# Altium schematic sheet PROBA.SchDoc: ATLAS_XP2V5
size 558 x 431 mm; Organization: IMP Automatika d.o.o.; Revision: V5
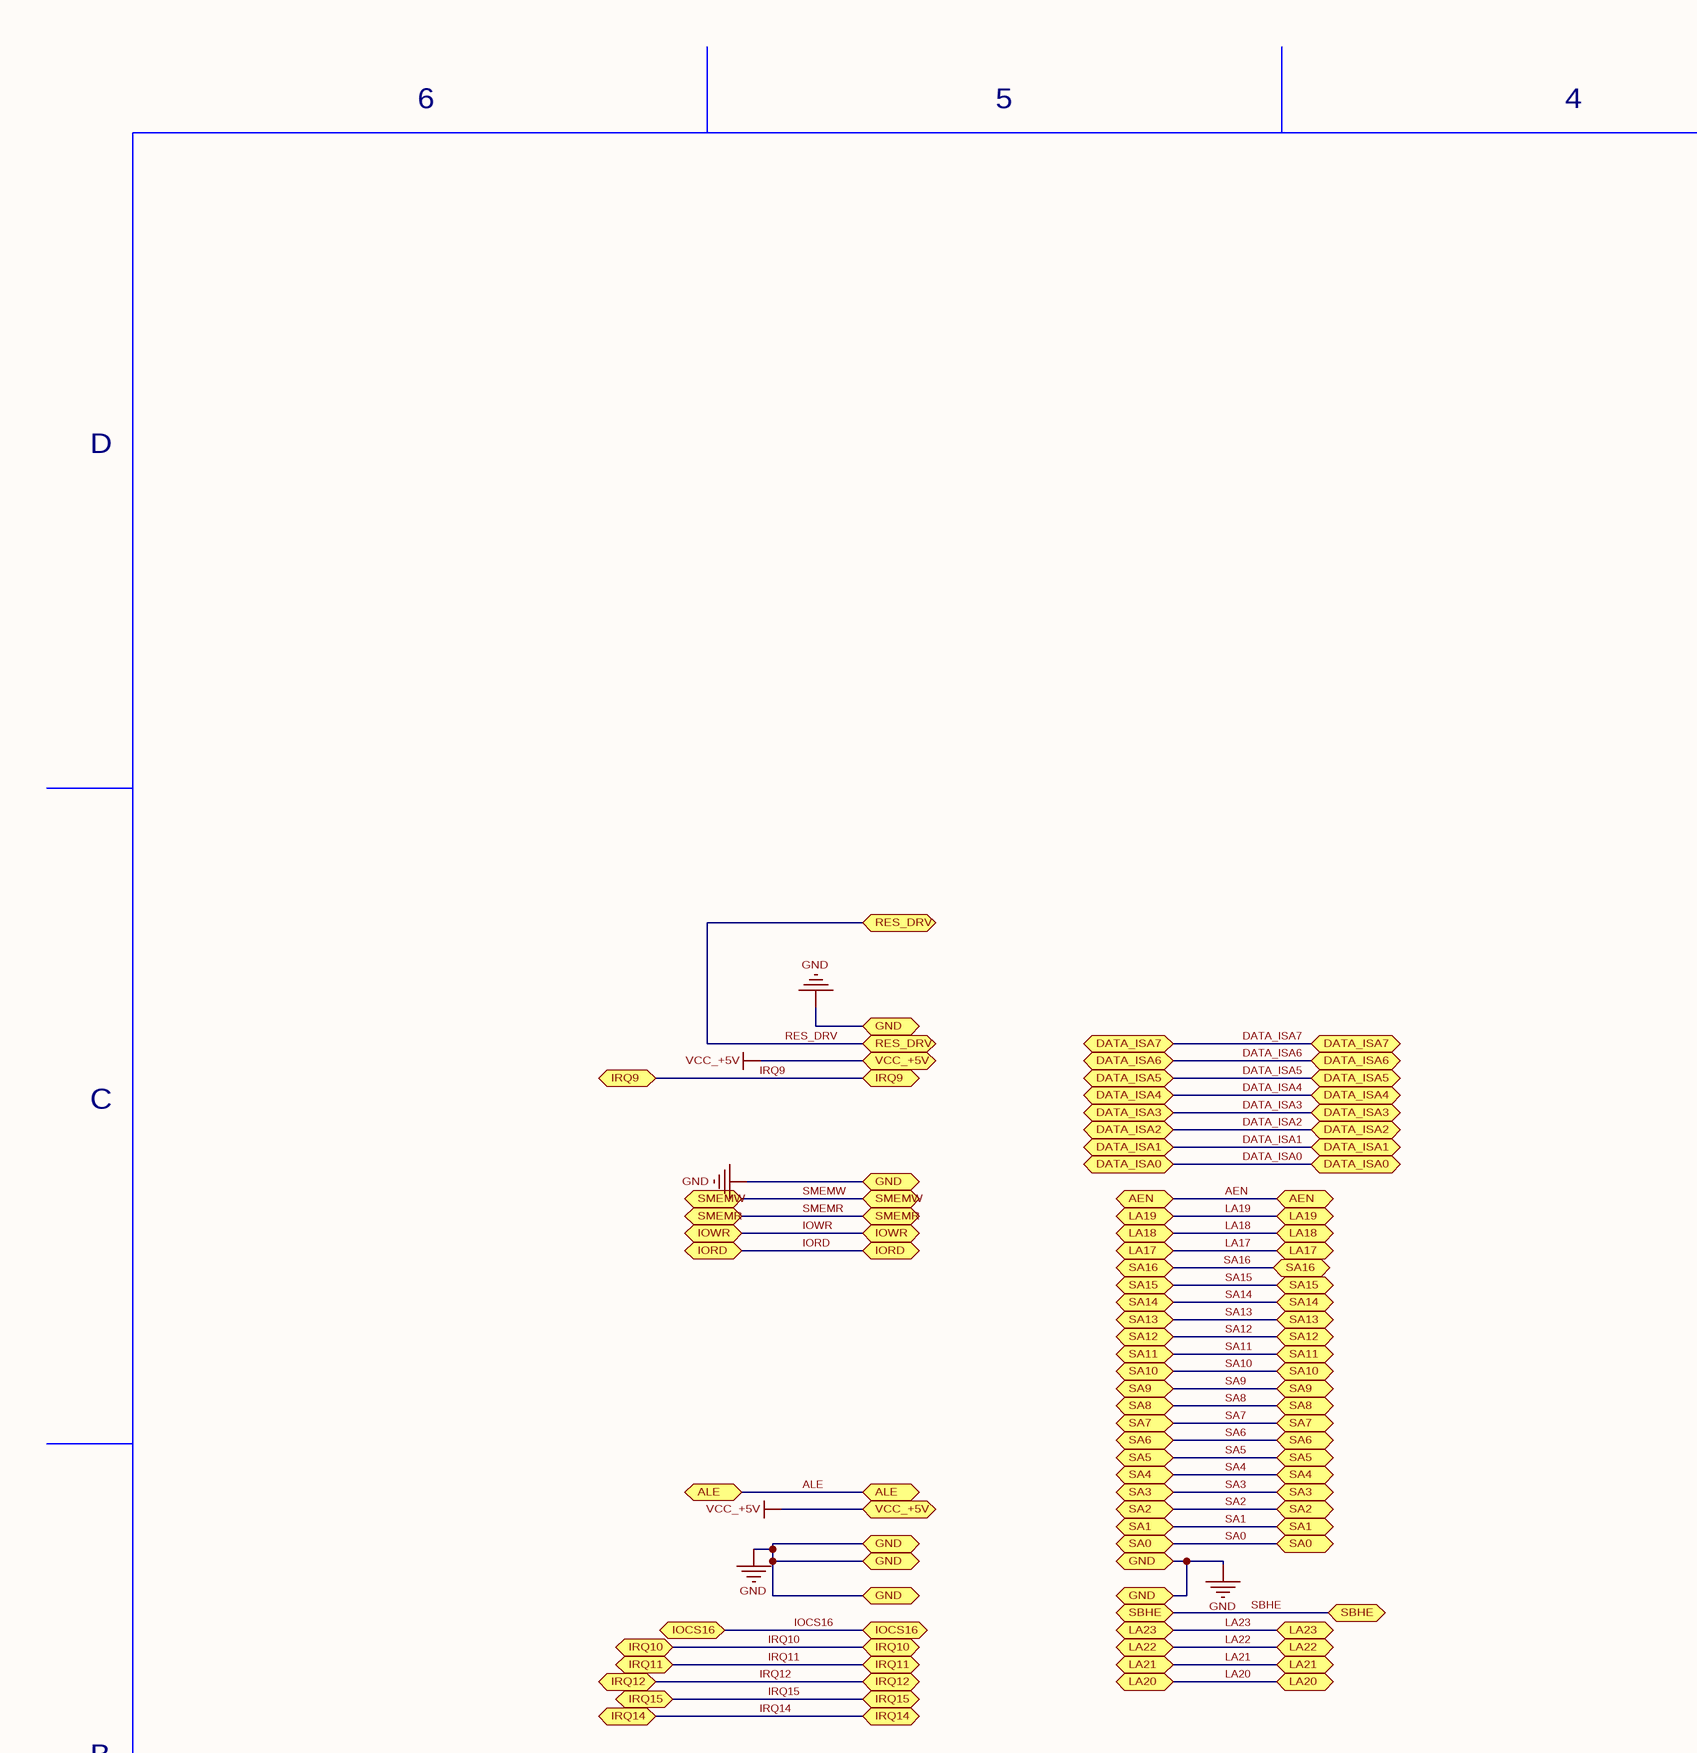
[diagram p0: PROBA.SchDoc, top left]
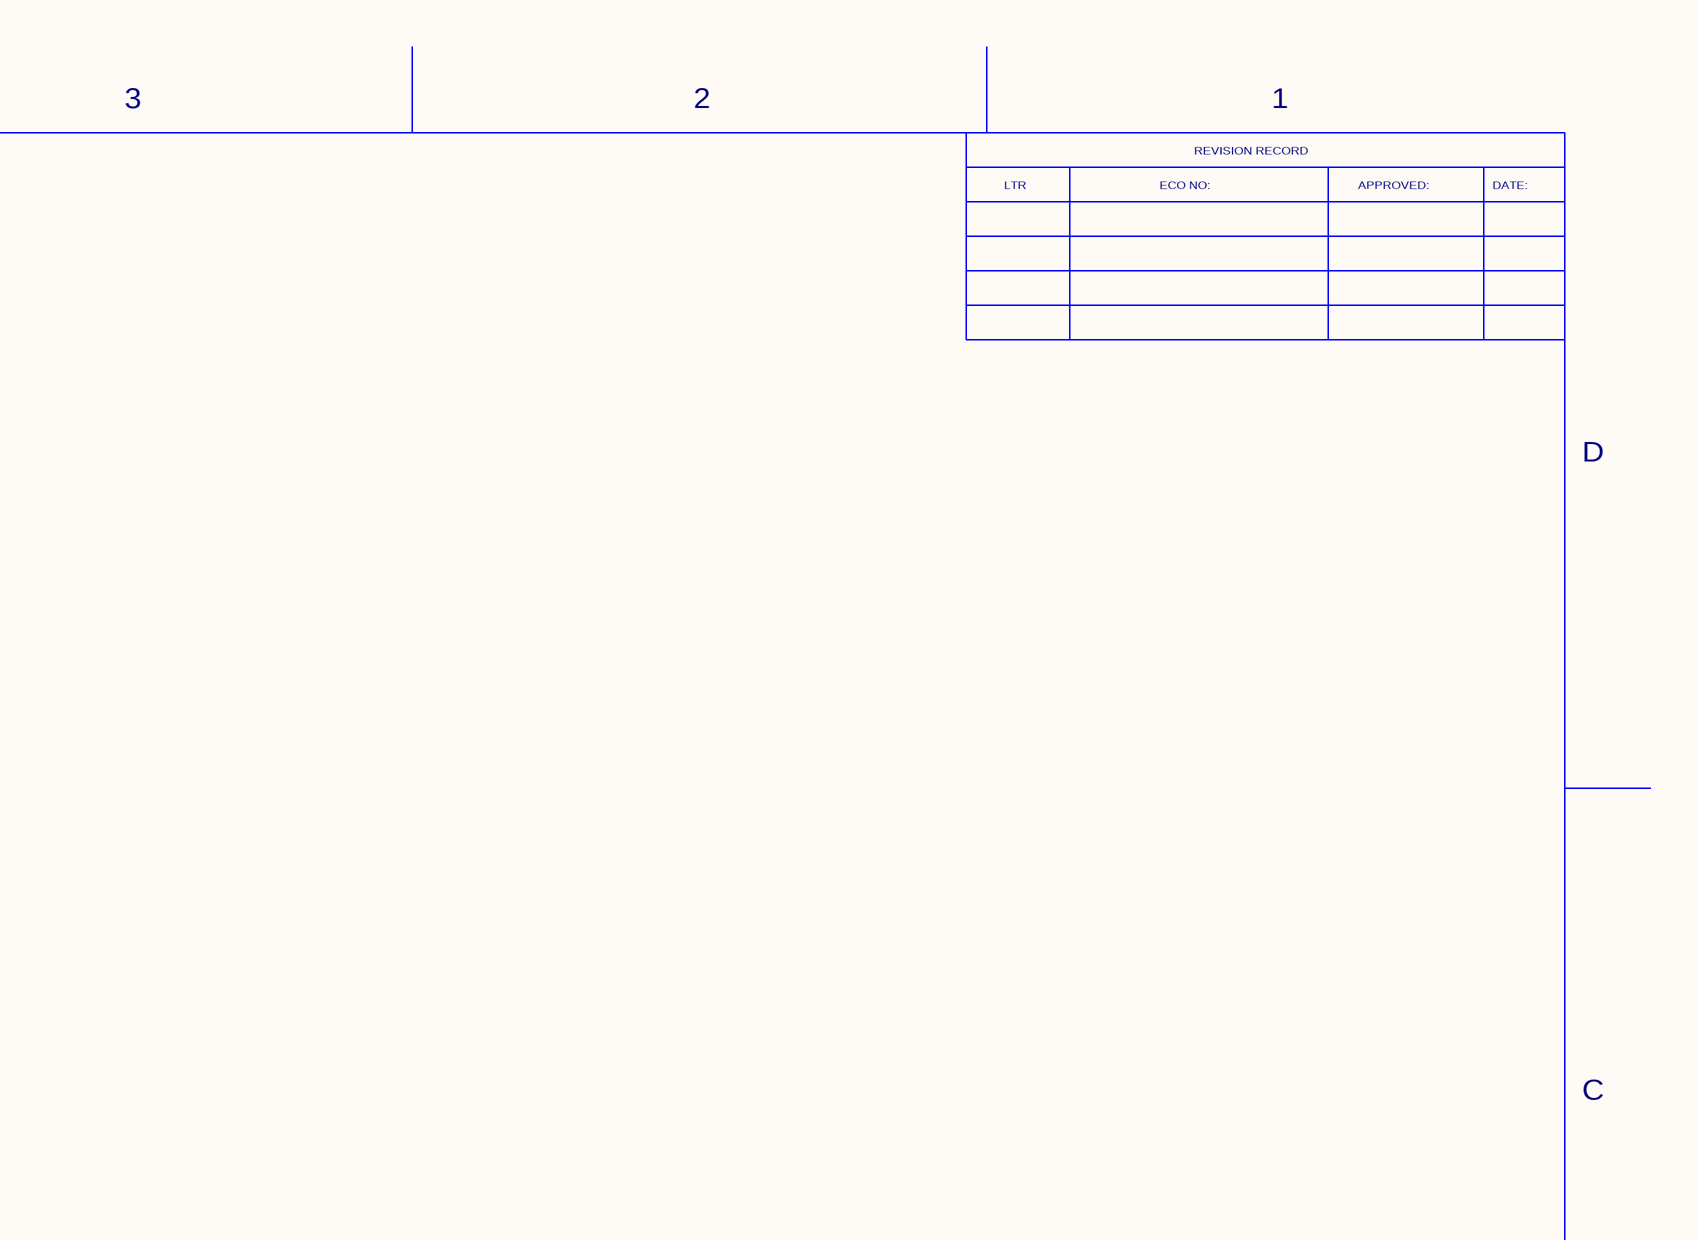
[diagram p1: PROBA.SchDoc, top right]
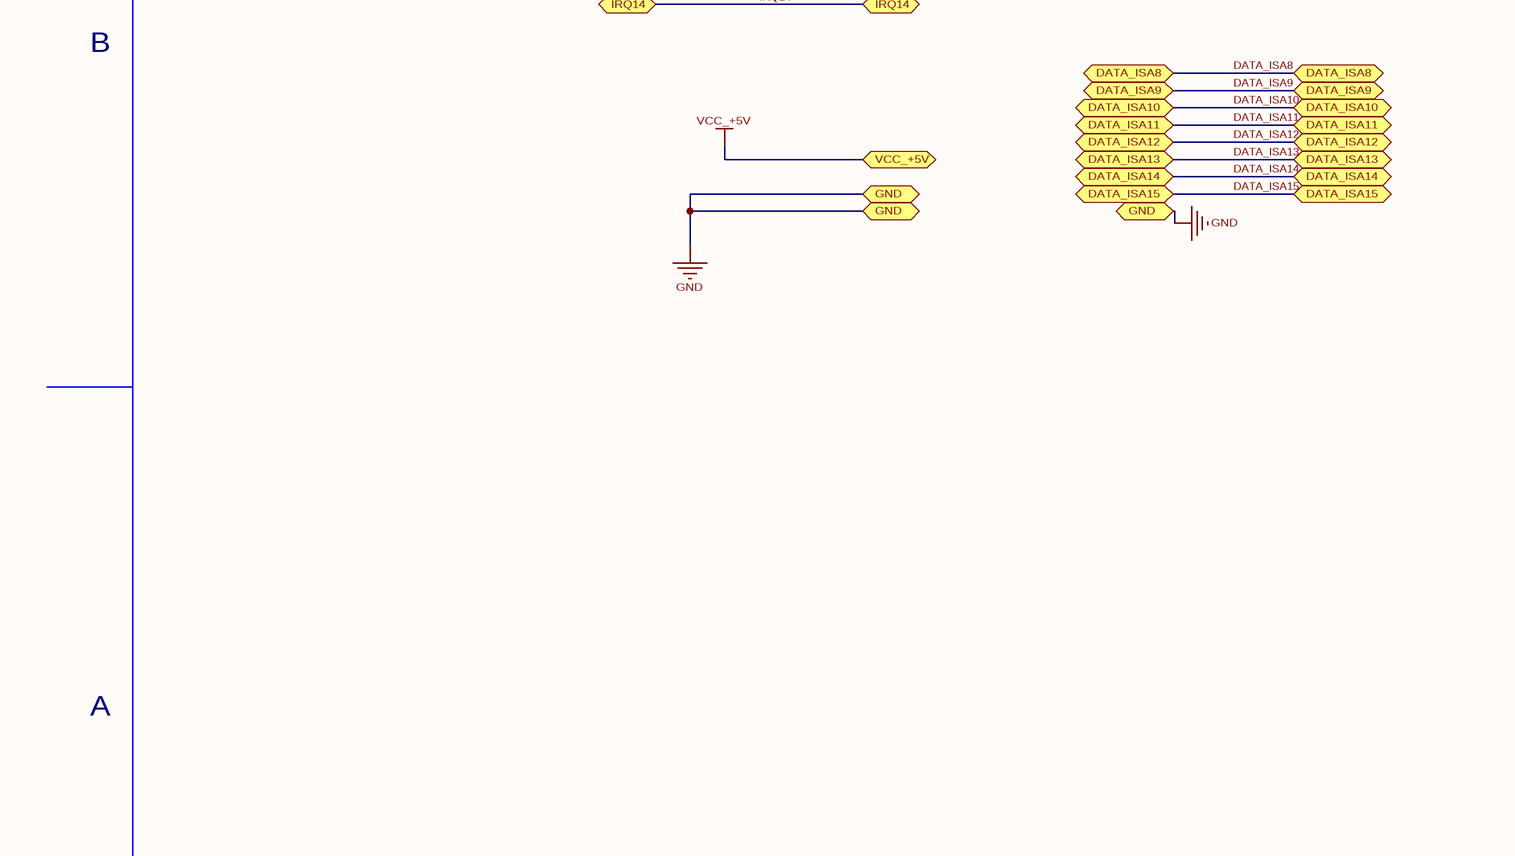
[diagram p2: PROBA.SchDoc, bottom left]
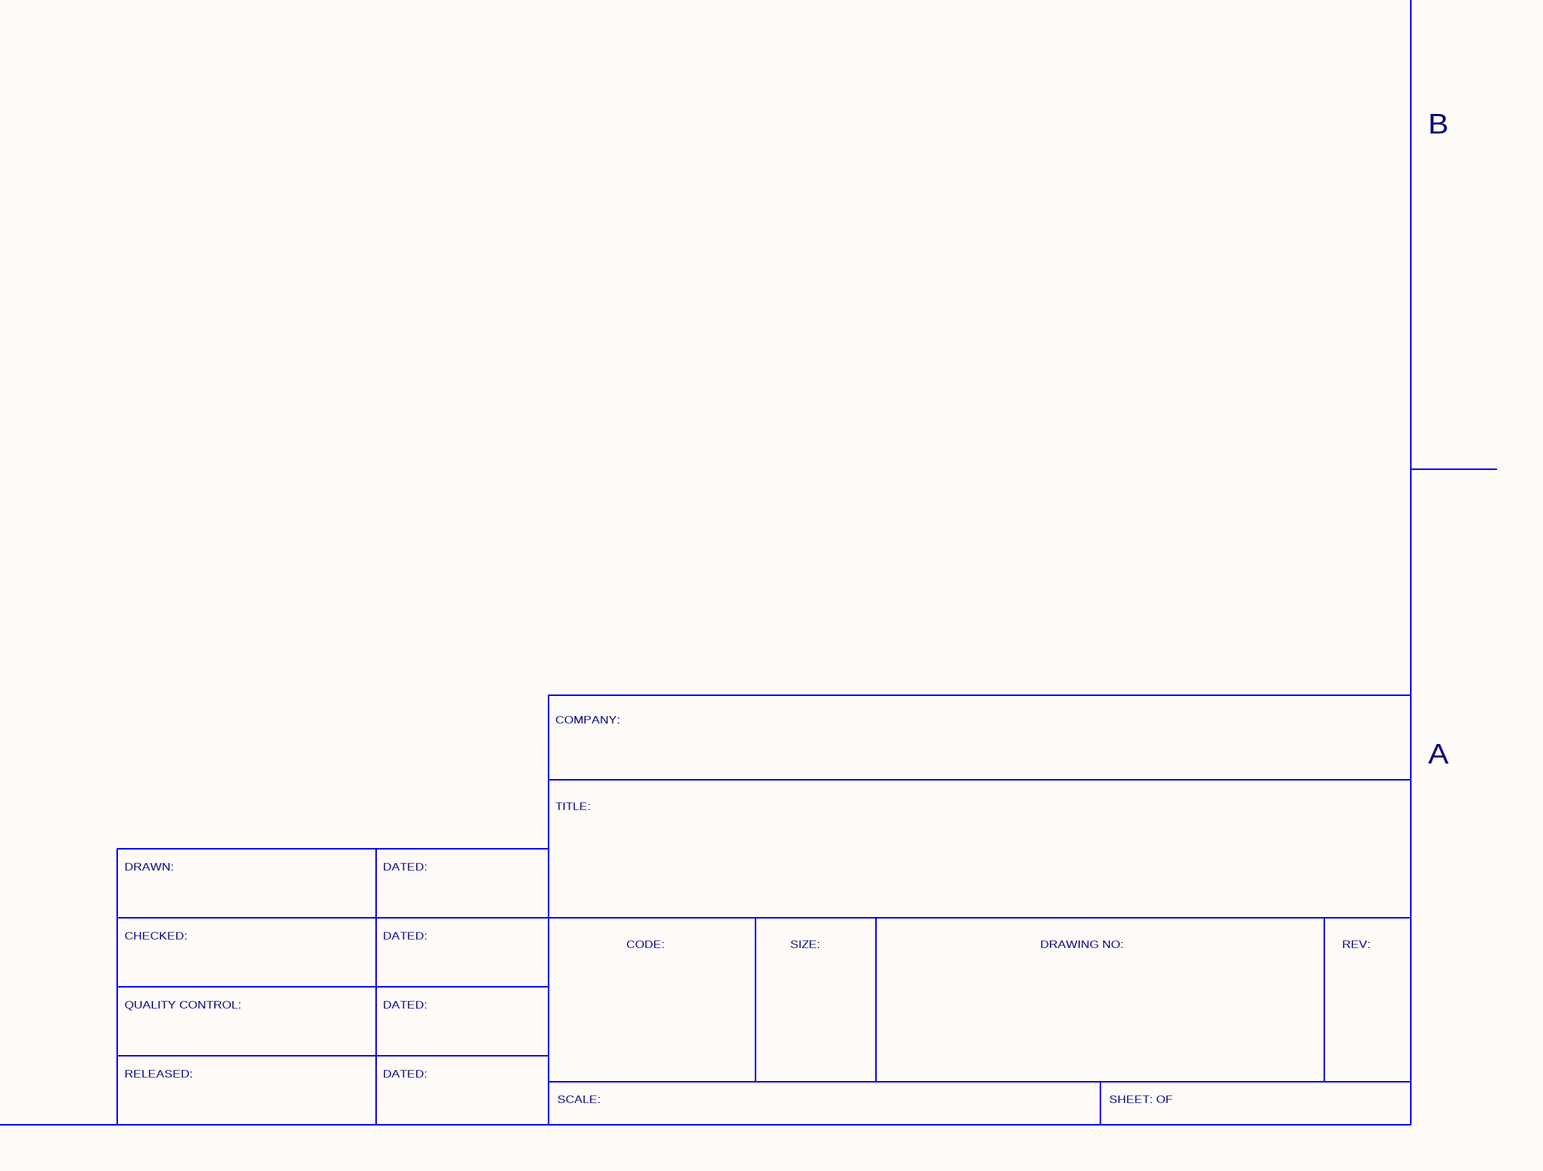
[diagram p3: PROBA.SchDoc, bottom right]

## Ports
AEN (bidir), ALE (bidir), DATA_ISA0 (bidir), DATA_ISA1 (bidir), DATA_ISA2 (bidir), DATA_ISA3 (bidir), DATA_ISA4 (bidir), DATA_ISA5 (bidir), DATA_ISA6 (bidir), DATA_ISA7 (bidir), DATA_ISA8 (bidir), DATA_ISA9 (bidir), DATA_ISA10 (bidir), DATA_ISA11 (bidir), DATA_ISA12 (bidir), DATA_ISA13 (bidir), DATA_ISA14 (bidir), DATA_ISA15 (bidir), GND (bidir), IOCS16 (bidir), IORD (bidir), IOWR (bidir), IRQ9 (bidir), IRQ10 (bidir), IRQ11 (bidir), IRQ12 (bidir), IRQ14 (bidir), IRQ15 (bidir), LA17 (bidir), LA18 (bidir), LA19 (bidir), LA20 (bidir), LA21 (bidir), LA22 (bidir), LA23 (bidir), RES_DRV (bidir), SA0 (bidir), SA1 (bidir), SA2 (bidir), SA3 (bidir), SA4 (bidir), SA5 (bidir), SA6 (bidir), SA7 (bidir), SA8 (bidir), SA9 (bidir), SA10 (bidir), SA11 (bidir), SA12 (bidir), SA13 (bidir), SA14 (bidir), SA15 (bidir), SA16 (bidir), SBHE (bidir), SMEMR (bidir), SMEMW (bidir), VCC_+5V (bidir)

## Nets
GND: port GND
VCC_+5V: port VCC_+5V
AEN: port AEN
ALE: port ALE
DATA_ISA0: port DATA_ISA0
DATA_ISA1: port DATA_ISA1
DATA_ISA2: port DATA_ISA2
DATA_ISA3: port DATA_ISA3
DATA_ISA4: port DATA_ISA4
DATA_ISA5: port DATA_ISA5
DATA_ISA6: port DATA_ISA6
DATA_ISA7: port DATA_ISA7
DATA_ISA8: port DATA_ISA8
DATA_ISA9: port DATA_ISA9
DATA_ISA10: port DATA_ISA10
DATA_ISA11: port DATA_ISA11
DATA_ISA12: port DATA_ISA12
DATA_ISA13: port DATA_ISA13
DATA_ISA14: port DATA_ISA14
DATA_ISA15: port DATA_ISA15
IOCS16: port IOCS16
IORD: port IORD
IOWR: port IOWR
IRQ9: port IRQ9
IRQ10: port IRQ10
IRQ11: port IRQ11
IRQ12: port IRQ12
IRQ14: port IRQ14
IRQ15: port IRQ15
LA17: port LA17
LA18: port LA18
LA19: port LA19
LA20: port LA20
LA21: port LA21
LA22: port LA22
LA23: port LA23
RES_DRV: port RES_DRV
SA0: port SA0
SA1: port SA1
SA2: port SA2
SA3: port SA3
SA4: port SA4
SA5: port SA5
SA6: port SA6
SA7: port SA7
SA8: port SA8
SA9: port SA9
SA10: port SA10
SA11: port SA11
SA12: port SA12
SA13: port SA13
SA14: port SA14
SA15: port SA15
SA16: port SA16
SBHE: port SBHE
SMEMR: port SMEMR
SMEMW: port SMEMW

## Notes on the sheet
- 6
- 5
- 4
- 3
- 2
- 1
- LTR
- ECO NO:
- REVISION RECORD
- APPROVED:
- DATE:
- D
- C
- B
- COMPANY:
- A
- TITLE:
- DRAWN:
- DATED:
- CHECKED:
- CODE:
- SIZE:
- DRAWING NO:
- REV:
- QUALITY CONTROL:
- RELEASED:
- SCALE:
- SHEET: OF